# EAGLE design Adafruit ENS160 (EAGLE 9.6.2)
COMPANY: ADAFRUIT INDUSTRIES; DRAWN: KTOWN; REV: A
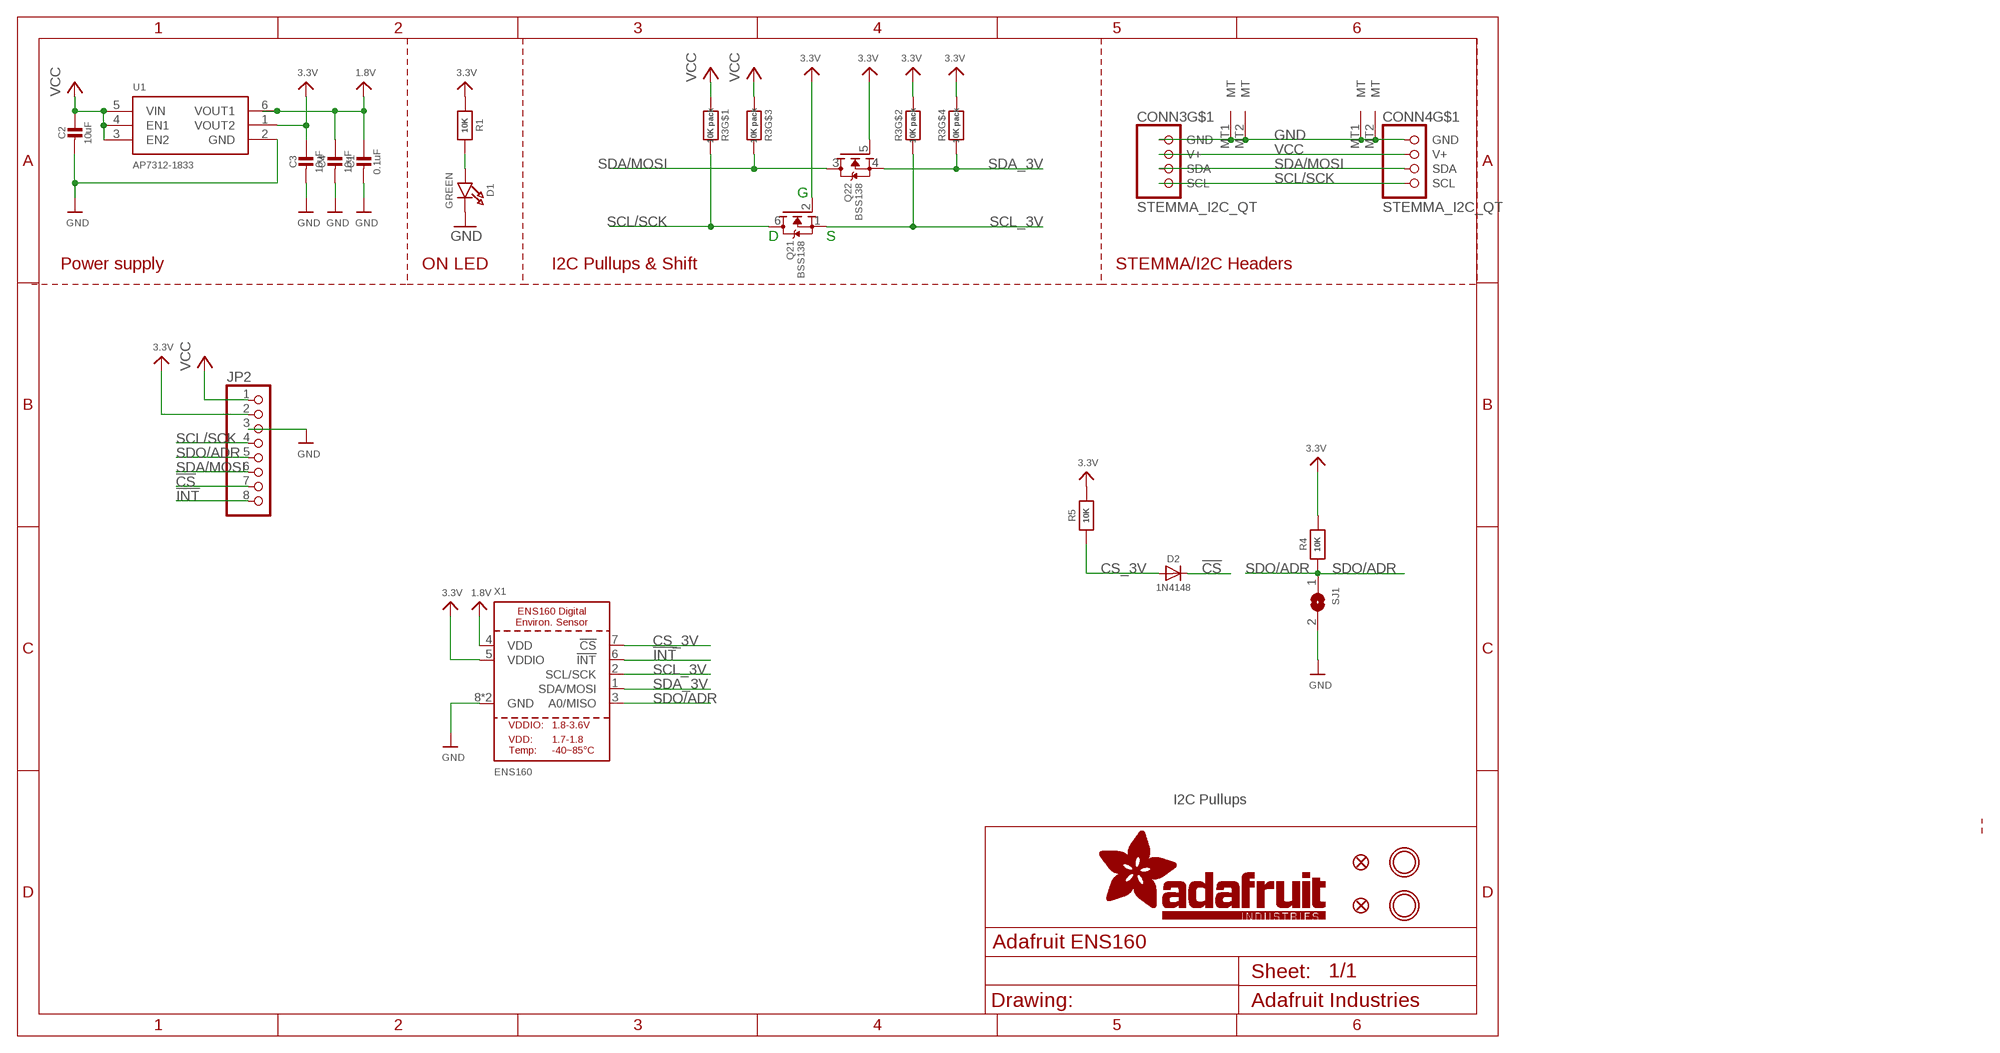
[diagram p0: schematic, sheet 1]

## Parts
C1  0.1uF  CAP_CERAMIC0603_NO  [0603-NO]
C2  10uF  CAP_CERAMIC0805-NOOUTLINE  [0805-NO]
C3  10uF  CAP_CERAMIC0805-NOOUTLINE  [0805-NO]
C4  10uF  CAP_CERAMIC0805-NOOUTLINE  [0805-NO]
CONN3  STEMMA_I2C_QT  [JST_SH4]
CONN4  STEMMA_I2C_QT  [JST_SH4]
D1  GREEN  LED0603_NOOUTLINE  [CHIPLED_0603_NOOUTLINE]
D2  1N4148  DIODESOD-323  [SOD-323]
FID3  FIDUCIAL_1MM  [FIDUCIAL_1MM]
FID4  FIDUCIAL_1MM  [FIDUCIAL_1MM]
JP2  HEADER-1X870MIL  [1X08_ROUND_70]
Q2  BSS138  MOSFET-N_DUAL  [SOT363]
R1  10K  RESISTOR_0603_NOOUT  [0603-NO]
R3  10K pack  RESISTOR_4PACK  [RESPACK_4X0603]
R4  10K  RESISTOR_0603_NOOUT  [0603-NO]
R5  10K  RESISTOR_0603_NOOUT  [0603-NO]
SJ1  SOLDERJUMPER  [SOLDERJUMPER_ARROW_NOPASTE]
U1  AP7312-1833  VREG_SOT23-6_DUALAP7312  [SOT23-6]
U$1  MOUNTINGHOLE2.5  [MOUNTINGHOLE_2.5_PLATED]
U$17  MOUNTINGHOLE2.5  [MOUNTINGHOLE_2.5_PLATED]
X1  ENS160  [ENS160]

## Nets
1.8V [lowpower]: C1.1 C4.1 U1.6(VOUT1) X1.4(VDD)
3.3V [lowpower]: C3.1 JP2.2 Q2.2(1:G) Q2.5(2:G) R1.1 R3.2 R3.4 R4.2 R5.2 U1.1(VOUT2) X1.5(VDDIO)
!CS: D2.C JP2.7
!INT: JP2.8 X1.6(!INT)
CS_3V: D2.A R5.1 X1.7(!CS)
GND [highpower]: C1.2 C2.2 C3.2 C4.2 CONN3.1(GND) CONN3.MT1(MT) CONN3.MT2(MT) CONN4.1(GND) CONN4.MT1(MT) CONN4.MT2(MT) D1.C JP2.3 SJ1.2 U1.2(GND) X1.8(GND) X1.9(GND)
N$1: D1.A R1.2
SCL/SCK: CONN3.4(SCL) CONN4.4(SCL) JP2.4 Q2.6(1:D) R3.8
SCL_3V: Q2.1(1:S) R3.7 X1.2(SCL/SCK)
SDA/MOSI: CONN3.3(SDA) CONN4.3(SDA) JP2.6 Q2.3(2:D) R3.6
SDA_3V: Q2.4(2:S) R3.5 X1.1(SDA/MOSI)
SDO/ADR: JP2.5 R4.1 SJ1.1 X1.3(A0/MISO)
VCC [highpower]: C2.1 CONN3.2(V+) CONN4.2(V+) JP2.1 R3.1 R3.3 U1.3(EN2) U1.4(EN1) U1.5(VIN)

## Notes on the sheet
- G
- D | S
- Power supply | ON LED | I2C Pullups & Shift | STEMMA/I2C Headers
- I2C Pullups

## Library data of the parts
C1-C4 = microbuilder:CAP_CERAMIC: Ceramic Capacitors For new designs, use the packages preceded by an '_' character since they are more reliable: The following footprints should be used on most boards: _0402 - Standard footprint for regular board layouts _0603 - Standard footprint for regular board layouts _0805 - Standard footprint for regular board layouts _1206 - Standard footprint for regular board layouts For extremely tight-pitch boards where space is at a premium, the following 'micro-pitch' footprints can be used (smaller pads, no silkscreen outline, etc.): _0402MP - Micro-pitch footprint for very dense/compact boards _0603MP - Micro-pitch footprint for very dense/compact boards _0805MP - Micro-pitch footprint for very dense/compact boards _1206MP - Micro-pitch footprint for very dense/compact boards
CONN3 CONN4 = adafruit_electromech:STEMMA_I2C; LCSC: C2845363
D1 = microbuilder:LED: LED 0603 - 0603 Surface Mount Package 2mA: Green LED - Low Power (3.9mcd, 2ma, 1.7Vf) - Digikey: 475-2709-2-ND Orange LED - Low Power (9.8mcd, 2ma, 1.8Vf) - Digikey: 475-1194-2-ND Red LED - Low Power (5mcd, 2ma, 1.8Vf) - Digikey: 475-1195-2-ND Yellow LED - Low Power (7mcd, 2ma, 1.8Vf) - Digikey: 475-1196-2-ND 5mA: Blue LED - Low Power (17mcd, 5ma, 2.9Vf) - Digikey: LNJ937W8CRACT-ND 0805 - 0805 Surface Mount Package 2mA: Red LED (8.8mcd, 2mA, 1.8Vf, Clear) - Low Power [Digikey: 475-2510-1-ND] Green LED (5mcd, 2mA, 1.8Vf, Clear) - Low Power [Digikey: 475-2730-1-ND] Yellow LED (11.3mcd, 2mA, 1.8Vf, Clear) - Low Power [Digikey: 475-2555-1-ND] 20mA: Red LED (104mcd, 20mA, Diffused) - LS R976 [Digikey: 475-1278-6-ND] Red LED (12mcd, 20mA, 2.0Vf, Clear) - APT2012EC [Digikey: 754-1128-1-ND] Green LED (15mcd, 20mA, 2.2Vf, Clear) - APT2012GC [Digikey: 754-1131-1-ND] Orange LED (160mcd, 20mA, 2.1Vf, Clear) - APT2012SECK [Digikey: 754-1130-1-ND] 1206 - 1206 Surface Mount Package Green LED (26mcd, 20mA, Diffused) - LG N971 [Digikey: 475-1407-6-ND] Red LED (15mcd, 20mA, Diffused) - LH N974 [Digikey: 475-1416-6-ND] Cree - Cree High-Power Surface Mount LEDs XPEBWT-L1-0000-00D50 - White 111lm 350mA 2.9Vf 6200K 110° XTEAWT-00-0000-00000LEE3 - White 114lm 350mA 2.85Vf 5000K 115° Everlight - Everlight 45-21 Series Surface Mount LEDs 45-21/QK2C-B2832AC2CB2/2T - Warm White 2000mcd 20mA 3.25Vf 3050K 120° 45-21/LK2C-B38452C4CB2/2T - Nuetral White 2000mcd 20mA 3.25Vf 4150K 120° 45-21/LK2C-B50634C6CB2/2T - Cold White 2200mcd 20mA 3.25Vf 5650K 120° PLCC2 Reverse Mount LS T77K-J1L2-1-0-2-R18-Z - Red 11.25mcd 2mA 1.8Vf 630nm 120° LO T77K-L1M2-24-Z - Orange 19.6mcd 2mA 1.8Vf 606nm 120° LY T77K-K2M1-26-Z - Yellow 15.7mcd 2mA 1.8Vf 587nm 120°; JLC_ROTATION: 270
D2 = microbuilder:DIODE: Diode SMA Model Volts Amps Type Vf Ir Digikey # Notes SSA34-E3 40V 3A Schottky 480mV @ 3A 200uA @ 40V SSA34-E3/61TGITR-ND CDBA120-G 20V 1A Schottky 500mV @ 1A 500uA @ 20V 641-1014-6-ND REEL MBRA210 10V 2A Schottky 350mV @ 2A 700uA @ 10V MBRA210LT3 SOD-123 Model Volts Amps Type Vf Ir Order # Notes BAT54T1G 30V 200mA Schottky 800mV @ 200mA 2uA @ 25V BAT54T1GOSTR-ND B0530W 30V 500mA Schottky 430mV @ 500mA 130uA @ 30V B0530W-FDICT-ND REEL MBR120 20V 1A Schottky 340mV @ 1A MBR120VLSFT1GOSCT-ND SOD-323 Model Volts Amps Type Vf Ir Order # Notes PMEG2005EJ 20V 500mA Schottky 355mV @ 500mA 568-4110-1-ND ZLLS410 10V 570mA Schottky 380mV @ 570mA ZLLS410CT-ND 1N4148WS 75V 150mA Silicon/Simple 1V 1N4148WSFSCT-ND REEL SOD-523 Model Volts Amps Type Vf Ir Order # Notes BAT54XV2 30V 200mA Schottky 0.8V @ 100mA BAT54XV2CT-ND TB751S 30V 30mA Schottky RB751S-40TE61CT-ND SOT23-R/W (R = Solder Paste/Reflow Ovens, W = Hand-Soldering) Model Volts Amps Type Vf Ir Order # Notes BAT54FILM 40V 300mA Schottky 497-7162-1-ND POWERDI-5 Model Volts Amps Type Vf Ir Order # Notes PDS560 60V 5A Schottky 670mV @ 5A 150uA @ 60V PDS560DICT-ND
FID3 FID4 = microbuilder:FIDUCIAL: Fiducial Alignment Points Various fiducial points for machine vision alignment.; BOM: EXCLUDE
JP2 = microbuilder:HEADER-1X8: PIN HEADER
Q2 = microbuilder:MOSFET-N_DUAL: Dual N-Channel MOSFET SOT363 (2.0x1.25mm) 2N7002PS - 60V, 320mA [Digikey: 568-5984-1-ND]; JLC_ROTATION: 270
R1 R4 R5 = microbuilder:RESISTOR: Resistors For new designs, use the packages preceded by an '_' character since they are more reliable: The following footprints should be used on most boards: _0402 - Standard footprint for regular board layouts _0603 - Standard footprint for regular board layouts _0805 - Standard footprint for regular board layouts _1206 - Standard footprint for regular board layouts For extremely tight-pitch boards where space is at a premium, the following 'micro-pitch' footprints can be used (smaller pads, no silkscreen outline, etc.): _0402MP - Micro-pitch footprint for very dense/compact boards _0603MP - Micro-pitch footprint for very dense/compact boards _0805MP - Micro-pitch footprint for very dense/compact boards _1206MP - Micro-pitch footprint for very dense/compact boards
R3 = microbuilder:RESISTOR_4PACK: Resistor Packs (4 resistors) 4 x 0603 10K 1/16W - Digikey: YC164J-10KCT-ND
SJ1 = microbuilder:SOLDERJUMPER: SMD Solder JUMPER Solder the two pads together to create a connection, or remove the solder to break it. REFLOW - Use this footprint for solder paste and reflow ovens. WAVE - Use this footprint for hand-soldering (larger pads). CLOSED - Has a trace between the two pads to ensure it is closed by default. The trace needs to be cut to disable the jumper, and can be closed again by creating a solder bridge between the two pads.; BOM: EXCLUDE
U1 = adafruit_power:VREG_SOT23-6_DUAL: Dual Output SOT23-6 Linear Regulators Diodes Inc. AP7312 - Dual 150mA LDO Linear Regulator 0.2V dropout, 150mA output, 2-6V Input AP7312-1833W6-7 - 1.8V/3.3V SOT23-6 (Digikey: AP7312-1833W6-7DICT-ND) MIC5320 - Dual 150mA ULDO Linear Regulator Ultra-low 35mV dropout at 150mA, 2.3-5.5V Input 3.3V/1.8V SOT23-6 (Digikey: 576-1658-1-ND) 3.3V/1.5V SOT23-6 (Digikey: 576-3483-1-ND)
U$1 U$17 = microbuilder:MOUNTINGHOLE: Mounting Hole For #2 screws (0.086"/2.18mm width, 0.094"/2.4mm hole) use 2.5mm; BOM: EXCLUDE
X1 = adafruit_sensor:ENS160

## Net classes
1 highpower: width 0.305 mm, drill 0.483 mm
2 lowpower: width 0.305 mm, drill 0.483 mm

## Board
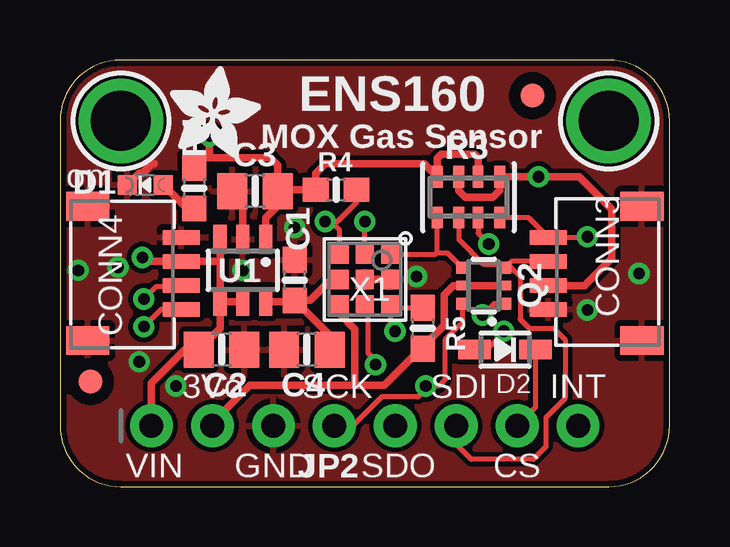
[diagram p1: board, top side]
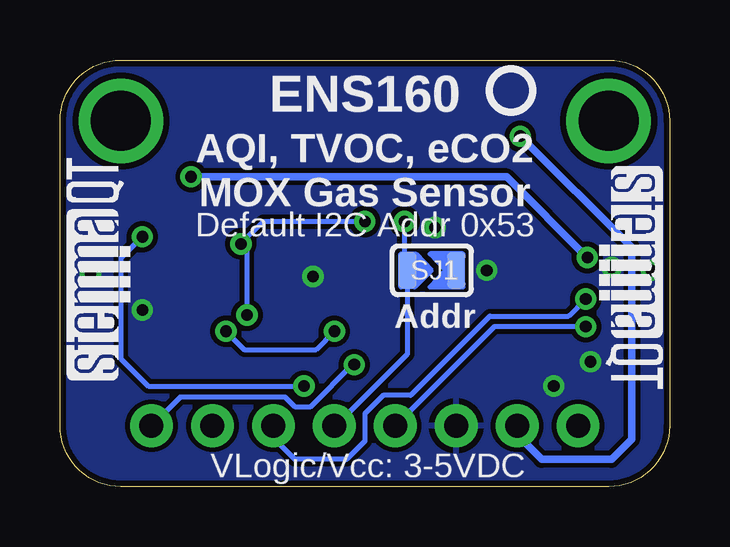
[diagram p2: board, bottom side, seen from below]

Size 25.4 x 17.78 mm. Coordinates in mm from the lower left corner, seen from the top.
Outline: 0,15.24 0,2.54 arc90 2.54,0 22.86,0 arc90 25.4,2.54 25.4,15.24 arc90 22.86,17.78 2.54,17.78 arc90 0,15.24
Copper layers (1*16): Top 0.035mm / dielectric 1.5mm / Bottom 0.035mm
Design rules "adafruit *": minimum track width 8mil, minimum drill 15.5mil, track to track 8mil, track to pad 8mil, pad to pad 8mil, via to via 8mil, smd to smd 8mil, copper to edge 10mil, drill to drill 8mil, minimum pad ring 10mil, minimum via ring 8mil, stop-mask expansion 2mil, vias tented up to drill 20mil, thermal gap 10mil

### Footprints (pad centres in the part's own frame; a part is rotated, then mirrored left to right if it is on the bottom)
0603-NO = smd 1.075 x 1: 1 -0.85,0; 2 0.85,0
0805-NO = smd 1.24 x 1.5: 1 -0.95,0; 2 0.95,0
JST_SH4 = smd 0.6 x 1.55: 1 -1.5,2.006; 2 -0.5,2.006; 3 0.5,2.006; 4 1.5,2.006 | smd 1.2 x 1.8: MT1 -2.8,-1.894; MT2 2.8,-1.894
CHIPLED_0603_NOOUTLINE = smd 0.8 x 0.8: A 0,-0.75; C 0,0.75
SOD-323 = smd 1.35 x 0.8: A 1.27,0; C -1.27,0
FIDUCIAL_1MM = smd 1 x 1: 1 0,0
1X08_ROUND_70 = drill 1 pad 1.778: 1 -8.89,0; 2 -6.35,0; 3 -3.81,0; 4 -1.27,0; 5 1.27,0; 6 3.81,0; 7 6.35,0; 8 8.89,0
SOT363 = smd 0.5 x 0.5: 1 -0.75,-0.9; 3 0.75,-0.9; 4 0.75,0.9; 6 -0.75,0.9 | smd 0.4 x 0.5: 2 0,-0.9; 5 0,0.9
RESPACK_4X0603 = smd 0.45 x 0.9: 1 -1.3,-0.85; 2 -0.4,-0.85; 3 0.4,-0.85; 4 1.3,-0.85; 5 1.3,0.85; 6 0.4,0.85; 7 -0.4,0.85; 8 -1.3,0.85
SOLDERJUMPER_ARROW_NOPASTE = smd 0.762 x 1.524: 1 -1.016,0; 2 1.016,0
SOT23-6 = smd 0.55 x 1.2: 1 -0.95,-1.3; 2 0,-1.3; 3 0.95,-1.3; 4 0.95,1.3; 5 0,1.3; 6 -0.95,1.3
MOUNTINGHOLE_2.5_PLATED = drill 2.5 pad 3.2: P$1 0,0
ENS160 = smd 0.8 x 0.75: 1 -1.05,1.05; 2 -1.05,0; 3 -1.05,-1.05; 4 0,-1.05; 5 1.05,-1.05; 6 1.05,0; 7 1.05,1.05; 8 0,1.05; 9 0,0

### Placement (x,y rotation side)
C1  9.78,8.61 90 top
C2  6.73,5.71 0 top
C3  8.13,12.32 180 top
C4  10.29,5.71 180 top
CONN3  22.35,8.89 90 top
CONN4  3.05,8.89 270 top
D1  3.56,12.57 90 top
D2  18.54,5.71 180 top
FID3  1.27,4.38 0 top
FID4  19.68,16.29 0 top
JP2  12.7,2.54 0 top
Q2  17.65,8.38 90 top
R1  5.59,12.45 270 top
R3  17.02,12.06 180 top
R4  11.51,12.37 180 top
R5  15.11,6.6 270 top
SJ1  9.91,9.02 0 bottom
U1  7.62,9.02 180 top
U$1  2.54,15.24 0 top
U$17  22.86,15.24 0 top
U$20  [ADAFRUIT_3.5MM]  4.57,13.72 0 top
U$25  [PCBFEAT-REV-040]  6.6,16.51 0 bottom
U$30  [STEMMAQT]  22.48,4.45 90 bottom
U$31  [STEMMAQT]  2.92,13.34 270 bottom
X1  12.7,8.64 270 top

### Tracks (layer width: path | path; a pad name or v marks a point on that pad's centre or on a via)
1.8V
  Top 0.305: U1.6 9.73,7.72 C1.1 | X1.4 11.3,8.64 10.43,7.76 C1.1 | C1.1 11.24,6.3 C4.1
3.3V  (via drill 0.48)
  Top 0.305: R1.1 6.01,13.72 6.22,13.72 | C3.1 9.08,13.4 8.76,13.72 6.22,13.72 | C3.1 9.08,11.71 8.57,11.21 U1.1 | X1.5 11.65,7.21 12.29,6.57 12.29,4.23 | JP2.2 6.35,2.67 7.91,4.23 12.29,4.23 | C3.1 9.13,12.37 R4.2 10.66,13.07 11.05,13.46 15.17,13.46 R3.4 15.72,13.69 15.88,13.84 17.27,13.84 17.42,13.7 R3.2 | Q2.2 Q2.5 16.38,8.38 16,8 16,6.73 15.11,5.84 R5.2 15.03,5.75 13.5,4.23 12.29,4.23 | 6.22,13.72 v6.22,14.61
  Bottom 0.305: JP2.2 6.35,2.16 5.33,1.14 2.41,1.14 1.59,1.97 1.59,9.97 v6.22,14.61
!CS
  Top 0.203: D2.C 19.81,3.3 JP2.7
!INT  (via drill 0.48)
  Top 0.203: X1.6 12.83,7.46 12.83,5.59 13.14,5.28 v13.14,5.08
  Bottom 0.203: v13.14,5.08 13.17,5.12 14.97,3.31 15.6,3.31 16.02,3.73 20.4,3.73 JP2.8
CS_3V  (via drill 0.48)
  Top 0.203: R5.1 13.62,7.45 X1.7 13.75,6.69 v13.96,6.48 | v18.49,6.48 18.49,6.42 17.78,5.71 D2.A
  Bottom 0.203: v13.96,6.48 14.73,5.71 17.73,5.71 v18.49,6.48
GND  (via drill 0.48)
  Top 0.305: X1.9 X1.8 | C3.2 7.62,11.88 U1.2 | D1.C 3.31,13.07 3.44,13.07 3.83,13.46 3.94,13.46
  other vias: 3.3,5.21 4.83,4.19 14.86,8.76 24.13,8.89 21.97,7.37 7.62,9.02 9.78,10.79 2.41,9.14 0.76,9.02
  pour Top: 0,17.78 25.4,17.78 25.4,0 0,0
  pour Bottom: 0,17.78 25.4,17.78 25.4,0 0,0
N$1
  Top 0.305: D1.A 5.28,11.6 R1.2
SCL/SCK  (via drill 0.48)
  Top 0.203: JP2.4 12.19,2.54 13.4,3.75 14.92,3.75 15.24,4.06 v15.24,4.19 15.78,4.19 16.04,4.45 16.04,6.11 16.75,6.83 Q2.6 | R3.8 19.52,11.21 CONN3.4 21.95,10.39 v21.97,10.41 | CONN4.4 4.21,7.39 v3.49,6.67
  Bottom 0.203: v3.49,6.67 7.3,6.67 JP2.4 | v21.97,10.41 22.86,9.53 22.86,5.33 21.72,4.19 v15.24,4.19
SCL_3V  (via drill 0.48)
  Top 0.203: R3.7 17.42,10.56 v17.86,10.12 | Q2.1 18.09,7.63 v17.61,7.16 | X1.2 v12.7,11.05
  Bottom 0.203: v17.61,7.16 17.61,9.86 v17.86,10.12 16.93,11.05 v12.7,11.05
SDA/MOSI  (via drill 0.48)
  Top 0.203: R3.6 16.62,10.3 17.66,9.26 18.43,9.26 Q2.3 | CONN3.3 18.81,9.39 Q2.3 | CONN4.3 5,8.33 4,8.33 v3.49,7.82 | Q2.3 18.81,9.13 19.18,8.76 19.18,6.99 19.56,6.6 20.57,6.6 21.05,6.13 21.05,3.68 20.24,2.88 20.24,1.67 19.72,1.14 17.14,1.14 16.51,1.78 JP2.6
  Bottom 0.203: v3.49,7.82 4.2,7.11 7.49,7.11 10.79,3.81 11.94,3.81 12.7,3.05 12.7,1.91 13.46,1.14 15.62,1.14 16.51,2.03 JP2.6
SDA_3V
  Top 0.203: X1.1 15.62,9.69 15.67,9.73 | 15.67,9.73 15.72,9.78 R3.5 | Q2.4 16.15,9.73 15.67,9.73
SDO/ADR  (via drill 0.48)
  Top 0.203: 11.54,11.05 v11.05,11.05 | R4.1 12.36,11.86 11.54,11.05 | 11.54,11.05 11.42,10.92 11.65,10.69 X1.3
  Bottom 0.203: v11.05,11.05 11.05,9.14 SJ1.1 10.92,5.52 13.91,2.54 JP2.5
VCC  (via drill 0.48)
  Top 0.305: U1.4 U1.5 | U1.3 6.67,9.4 | 6.67,9.4 U1.4 | 6.67,9.4 5.06,9.4 CONN4.2 3.59,9.39 v3.43,9.55 | JP2.1 3.81,4.32 5.21,5.71 C2.1 6.67,6.6 U1.4 | R3.3 16.62,12.34 16.89,12.06 18.03,12.06 18.32,12.35 R3.1 v19.94,12.91 21.63,12.91 22.99,11.56 22.99,9.53 21.84,8.38 CONN3.2
  Bottom 0.305: v3.43,9.55 6.79,12.91 v19.94,12.91

### Text on the board
tPlace: ENS160 | MOX Gas Sensor | on | 3Vo | SCK | SDI | INT | VIN | GND | SDO | CS
bPlace: ENS160 | AQI, TVOC, eCO2 / MOX Gas Sensor | Default I2C Addr 0x53 | Addr | VLogic/Vcc: 3-5VDC